# EAGLE design LED Light (EAGLE 6.5.0)
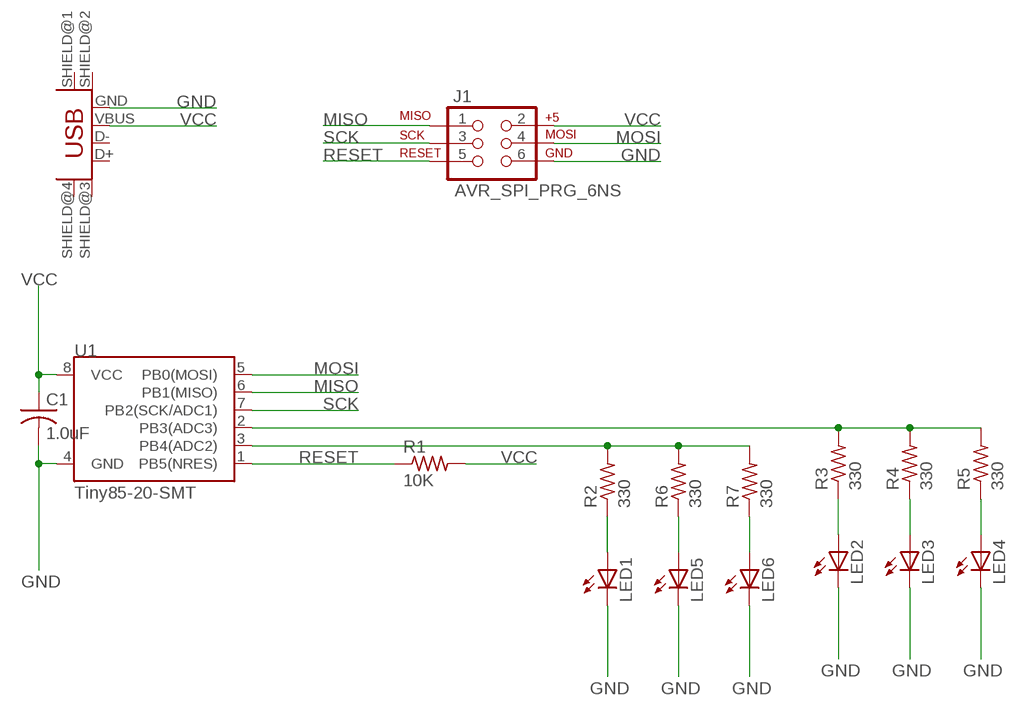
[diagram p0: schematic, sheet 1]

## Parts
C1  1.0uF  C-USC1206  [C1206]
J1  AVR_SPI_PRG_6NS  [2X3-NS]
JP1  USB_MINIB  [USB_MINIB]
LED1  LEDSMT1206  [1206]
LED2  LEDSMT1206  [1206]
LED3  LEDSMT1206  [1206]
LED4  LEDSMT1206  [1206]
LED5  LEDSMT1206  [1206]
LED6  LEDSMT1206  [1206]
R1  10K  R-US_R1206  [R1206]
R2  330  R-US_R1206  [R1206]
R3  330  R-US_R1206  [R1206]
R4  330  R-US_R1206  [R1206]
R5  330  R-US_R1206  [R1206]
R6  330  R-US_R1206  [R1206]
R7  330  R-US_R1206  [R1206]
U1  Tiny85-20-SMT  ATTINY45TINY85-20-SMT  [SO08-EIAJ]

## Nets
GND: C1.2 J1.6 JP1.GND LED1.C LED2.C LED3.C LED4.C LED5.C LED6.C U1.4(GND)
MISO: J1.1 U1.6(PB1(MISO))
MOSI: J1.4 U1.5(PB0(MOSI))
N$1: R2.2 R6.2 R7.2 U1.3(PB4(ADC2))
N$2: R3.2 R4.2 R5.2 U1.2(PB3(ADC3))
N$3: LED1.A R2.1
N$4: LED2.A R3.1
N$5: LED6.A R7.1
N$6: LED5.A R6.1
N$7: LED3.A R4.1
N$8: LED4.A R5.1
RESET: J1.5 R1.1 U1.1(PB5(NRES))
SCK: J1.3 U1.7(PB2(SCK/ADC1))
VCC: C1.1 J1.2 JP1.VBUS R1.2 U1.8(VCC)
Unconnected: JP1.D+ JP1.D- JP1.SHIELD@1(SHIELD) JP1.SHIELD@2(SHIELD1) JP1.SHIELD@3(SHIELD2) JP1.SHIELD@4(SHIELD3)

## Library data of the parts
C1 = rcl:C-US: CAPACITOR, American symbol
J1 = SparkFun-Connectors:AVR_SPI_PRG_6: AVR ISP 6 Pin This is the reduced ISP connector for AVR programming. Common on Arduino. This footprint will take up less PCB space and can be used with a 10-pin to 6-pin adapter such as SKU: BOB-08508 **Special note about "TEST_POINT" package. The stop mask is on the top side, so if you want your programming test points to be on the bottom of your board, make sure to place this package on the bottom side of the board. This also ensure that the orientation to program from the bottom side will be correct.
JP1 = fab:USB_MINIB
LED1-LED6 = led:LED: LED OSRAM: - CHIPLED LG R971, LG N971, LY N971, LG Q971, LY Q971, LO R971, LY R971 LH N974, LH R974 LS Q976, LO Q976, LY Q976 LO Q996 - Hyper CHIPLED LW Q18S LB Q993, LB Q99A, LB R99A - SideLED LS A670, LO A670, LY A670, LG A670, LP A670 LB A673, LV A673, LT A673, LW A673 LH A674 LY A675 LS A676, LA A676, LO A676, LY A676, LW A676 LS A679, LY A679, LG A679 - Hyper Micro SIDELED® LS Y876, LA Y876, LO Y876, LY Y876 LT Y87S - SmartLED LW L88C, LW L88S LB L89C, LB L89S, LG L890 LS L89K, LO L89K, LY L89K LS L896, LA L896, LO L896, LY L896 - TOPLED LS T670, LO T670, LY T670, LG T670, LP T670 LSG T670, LSP T670, LSY T670, LOP T670, LYG T670 LG T671, LOG T671, LSG T671 LB T673, LV T673, LT T673, LW T673 LH T674 LS T676, LA T676, LO T676, LY T676, LB T676, LH T676, LSB T676, LW T676 LB T67C, LV T67C, LT T67C, LS T67K, LO T67K, LY T67K, LW E67C LS E67B, LA E67B, LO E67B, LY E67B, LB E67C, LV E67C, LT E67C LW T67C LS T679, LY T679, LG T679 LS T770, LO T770, LY T770, LG T770, LP T770 LB T773, LV T773, LT T773, LW T773 LH T774 LS E675, LA E675, LY E675, LS T675 LS T776, LA T776, LO T776, LY T776, LB T776 LHGB T686 LT T68C, LB T68C - Hyper Mini TOPLED® LB M676 - Mini TOPLED Santana® LG M470 LS M47K, LO M47K, LY M47K Source: http://www.osram.convergy.de LUXEON: - LUMILED® LXK2-PW12-R00, LXK2-PW12-S00, LXK2-PW14-U00, LXK2-PW14-V00 LXK2-PM12-R00, LXK2-PM12-S00, LXK2-PM14-U00 LXK2-PE12-Q00, LXK2-PE12-R00, LXK2-PE12-S00, LXK2-PE14-T00, LXK2-PE14-U00 LXK2-PB12-K00, LXK2-PB12-L00, LXK2-PB12-M00, LXK2-PB14-N00, LXK2-PB14-P00, LXK2-PB14-Q00 LXK2-PR12-L00, LXK2-PR12-M00, LXK2-PR14-Q00, LXK2-PR14-R00 LXK2-PD12-Q00, LXK2-PD12-R00, LXK2-PD12-S00 LXK2-PH12-R00, LXK2-PH12-S00 LXK2-PL12-P00, LXK2-PL12-Q00, LXK2-PL12-R00 Source: www.luxeon.com KINGBRIGHT: KA-3528ASYC Source: www.kingbright.com
R1-R7 = rcl:R-US_: RESISTOR, American symbol
U1 = SparkFun-DigitalIC:ATTINY45: Atmel 8-pin 2/4/8kB flash uC; PROD_ID: IC-09092

## Board
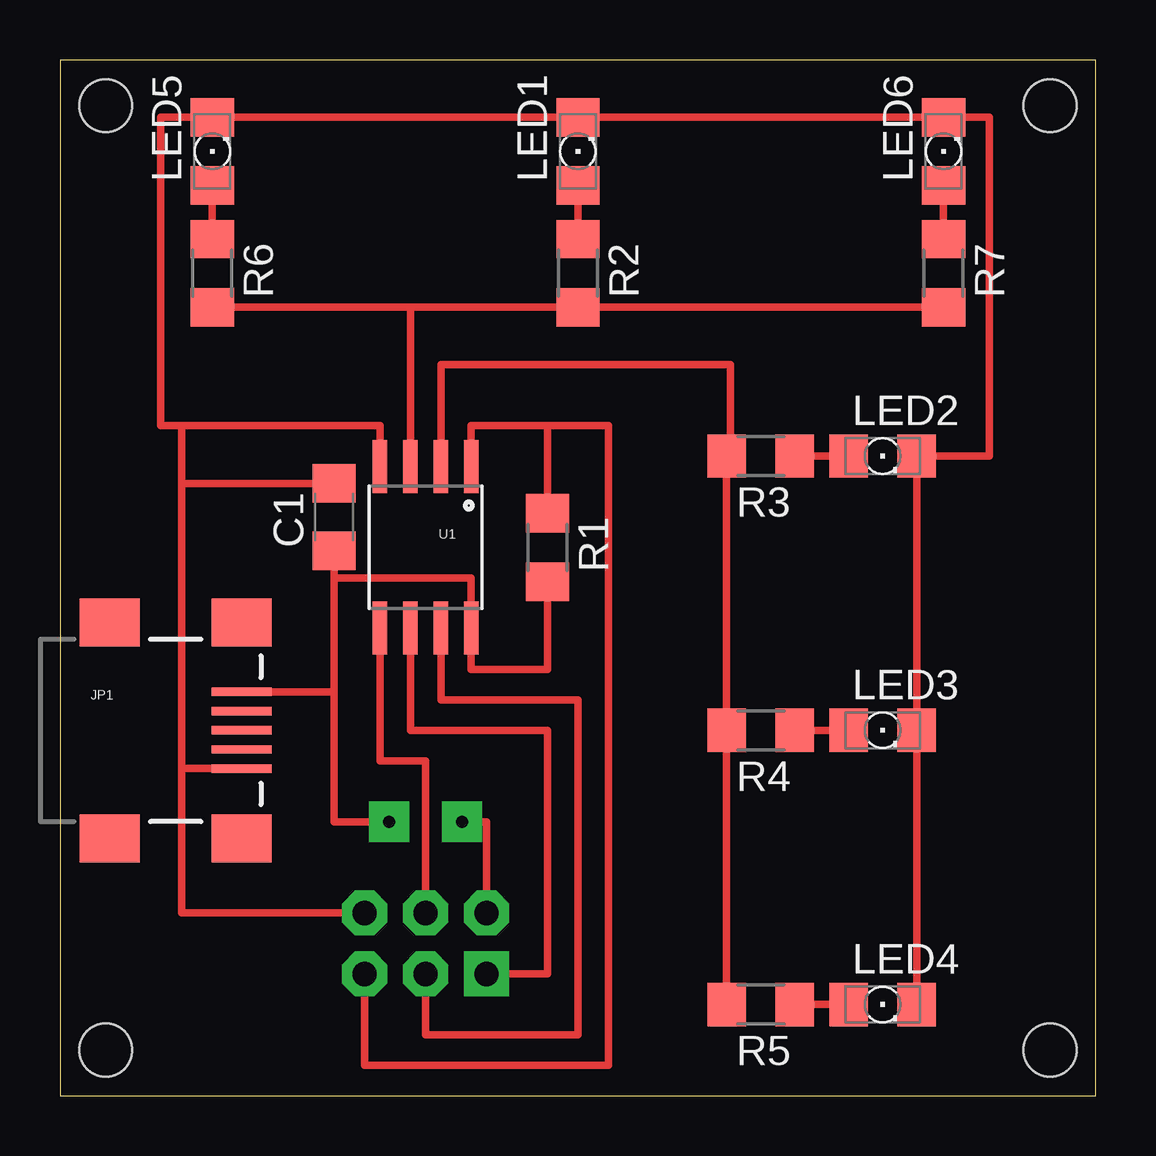
[diagram p1: board, top side]
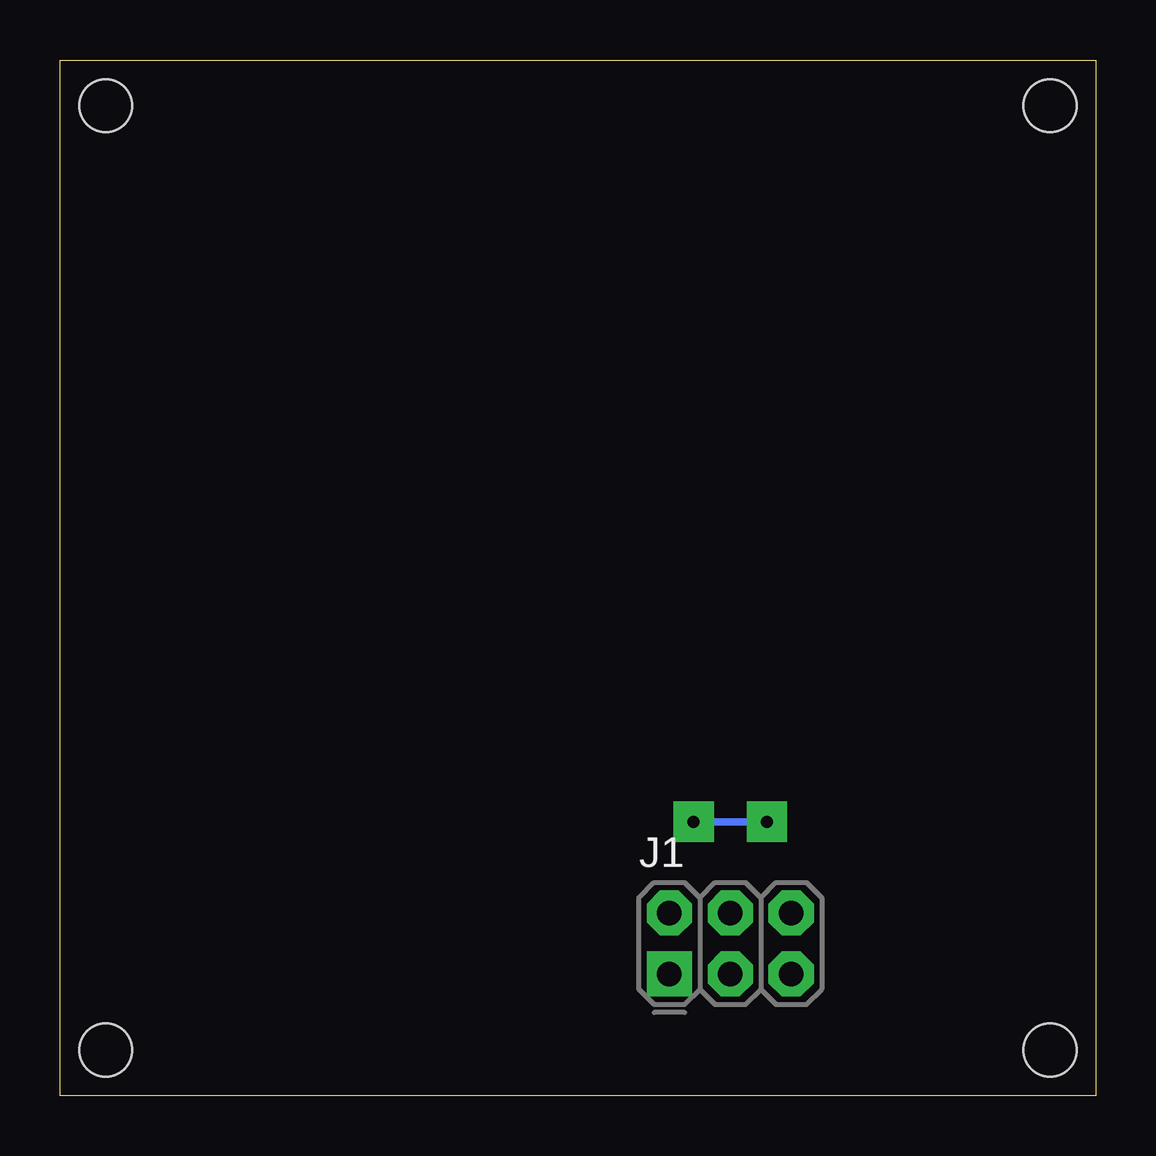
[diagram p2: board, bottom side, seen from below]

Size 43.18 x 43.18 mm. Coordinates in mm from the lower left corner, seen from the top.
Outline: 0,0 43.18,0 43.18,43.18 0,43.18 0,0
Copper layers (1*16): Top 0.035mm / dielectric 1.5mm / Bottom 0.035mm
Design rules "default *": minimum track width 12mil, minimum drill 24mil, track to track 17mil, track to pad 17mil, pad to pad 17mil, via to via 17mil, smd to smd 8mil, copper to edge 40mil, drill to drill 8mil, minimum pad ring 10mil, minimum via ring 8mil, stop-mask expansion 4mil, vias tented up to drill 0mil, thermal gap 10mil
Holes 2.2 mm at 1.91,41.27 1.91,1.91 41.27,1.91 41.27,41.27

### Footprints (pad centres in the part's own frame; a part is rotated, then mirrored left to right if it is on the bottom)
C1206 = smd 1.6 x 1.8: 1 -1.4,0; 2 1.4,0
2X3-NS = drill 1.016 pad 1.88 square: 1 -2.54,-1.27 | drill 1.016 pad 1.88 octagon: 2 -2.54,1.27; 3 0,-1.27; 4 0,1.27; 5 2.54,-1.27; 6 2.54,1.27
USB_MINIB = smd 2.5 x 0.35: D+ 3.77,0; D- 3.77,0.8; GND 3.77,-1.6; ID 3.77,-0.8; VBUS 3.77,1.6 | smd 2.5 x 2: SHIELD@1 -1.73,-4.5; SHIELD@2 -1.73,4.5; SHIELD@3 3.77,4.5; SHIELD@4 3.77,-4.5
1206 = smd 1.6 x 1.803: A -1.422,0; C 1.422,0
R1206 = smd 1.6 x 1.803: 1 -1.422,0; 2 1.422,0
SO08-EIAJ = smd 0.61 x 2.21: 1 -1.905,-3.378; 2 -0.635,-3.378; 3 0.635,-3.378; 4 1.905,-3.378; 5 1.905,3.353; 6 0.635,3.353; 7 -0.635,3.353; 8 -1.905,3.353

### Placement (x,y rotation side)
C1  11.43,24.13 90 top
J1  15.24,6.35 0 bottom
JP1  3.81,15.24 0 top
LED1  21.59,39.37 90 top
LED2  34.29,26.67 0 top
LED3  34.29,15.24 0 top
LED4  34.29,3.81 0 top
LED5  6.35,39.37 90 top
LED6  36.83,39.37 90 top
R1  20.32,22.86 270 top
R2  21.59,34.29 270 top
R3  29.21,26.67 180 top
R4  29.21,15.24 180 top
R5  29.21,3.81 180 top
R6  6.35,34.29 270 top
R7  36.83,34.29 270 top
U1  15.24,22.86 180 top

### Tracks (layer width: path | path; a pad name or v marks a point on that pad's centre or on a via)
GND
  Top 0.305: U1.4 13.34,27.94 5.08,27.94 | 5.08,25.53 5.08,13.64 | 5.08,13.64 5.08,7.62 J1.6 | 5.08,27.94 5.08,25.53 | 5.08,25.53 C1.2 | JP1.GND 5.08,13.64 | LED4.C LED3.C LED2.C 38.73,26.67 38.73,40.79 LED6.C LED1.C LED5.C 4.19,40.79 4.19,27.94 5.08,27.94
MISO
  Top 0.305: U1.6 14.61,15.24 20.32,15.24 20.32,5.08 J1.1
MOSI
  Top 0.305: U1.5 13.34,13.97 15.24,13.97 J1.4
N$1
  Top 0.305: U1.3 14.61,32.87 | 14.61,32.87 R6.2 | 14.61,32.87 R2.2 R7.2
N$2
  Top 0.305: U1.2 15.88,30.48 27.94,30.48 27.94,26.67 R3.2 R4.2 R5.2
N$3
  Top 0.305: LED1.A R2.1
N$4
  Top 0.305: R3.1 LED2.A
N$5
  Top 0.305: LED6.A R7.1
N$6
  Top 0.305: LED5.A R6.1
N$7
  Top 0.305: R4.1 LED3.A
N$8
  Top 0.305: R5.1 LED4.A
RESET
  Top 0.305: U1.1 17.14,27.94 20.32,27.94 | 20.32,27.94 22.86,27.94 22.86,1.27 12.7,1.27 J1.5 | R1.1 20.32,27.94
SCK
  Top 0.305: U1.7 15.88,16.51 21.59,16.51 21.59,2.54 15.24,2.54 J1.3
VCC  (via drill 0.5 pad 1.68)
  Top 0.305: J1.2 17.78,11.43 v16.76,11.43 | v13.72,11.43 11.43,11.43 11.43,16.84 | 11.43,21.59 17.14,21.59 U1.8 17.14,17.78 20.32,17.78 R1.2 | C1.1 11.43,21.59 | 11.43,21.59 11.43,16.84 | 11.43,16.84 JP1.VBUS
  Bottom 0.305: v16.76,11.43 v13.72,11.43